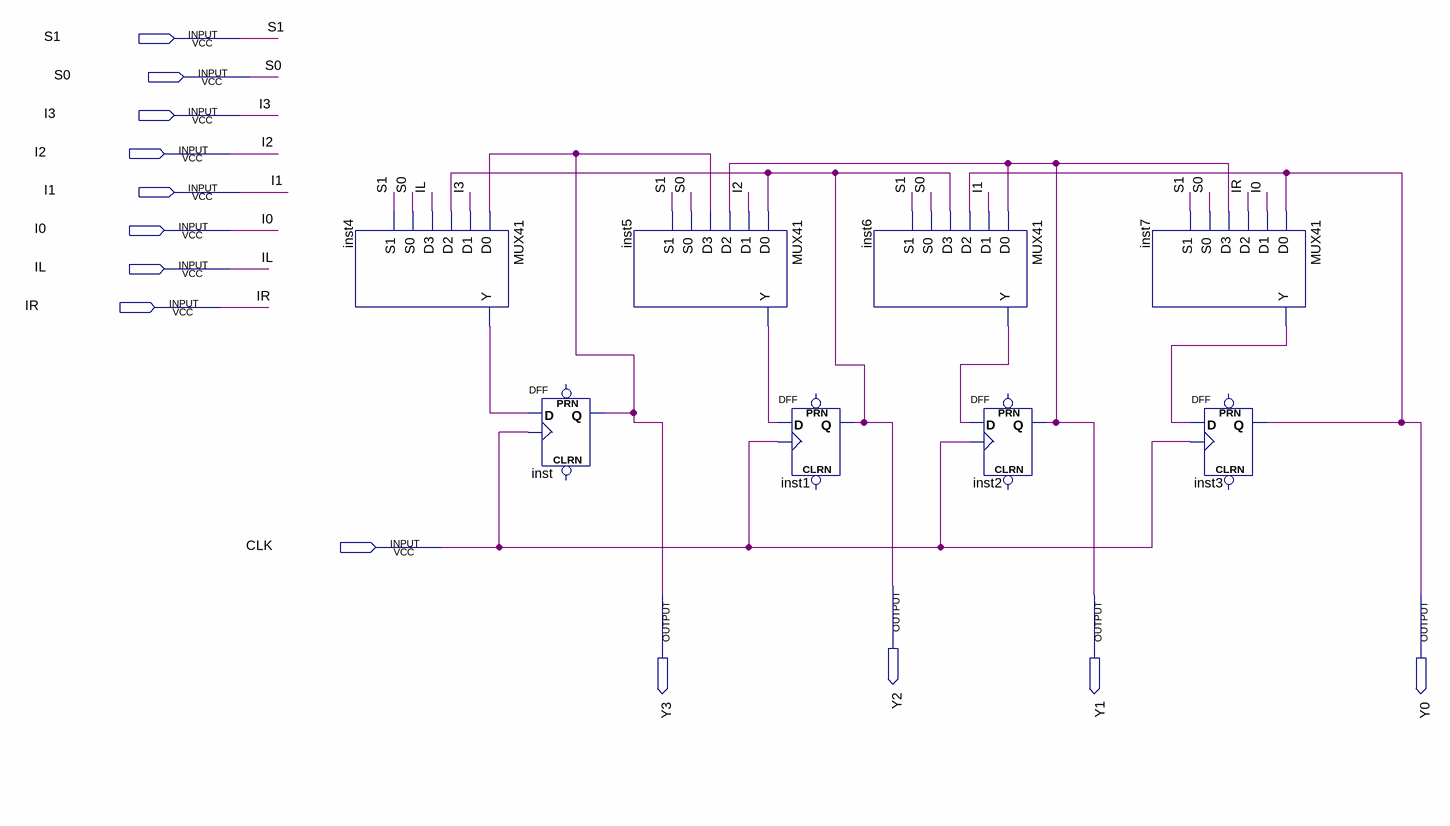
[diagram p0: schematic sheet]
// Quartus schematic Res_4choice.bdf as structural Verilog: 8 symbols, 13 pins
module Res_4choice (
  input  S1,
  input  S0,
  input  I3,
  input  I2,
  input  I1,
  input  I0,
  input  IL,
  input  IR,
  input  CLK,
  output Y2,
  output Y3,
  output Y1,
  output Y0
);

  wire inst4_y, inst5_y, inst6_y, inst7_y;

  MUX41 inst4 (.D0(Y3), .D1(I3), .D2(Y2), .D3(IL), .S0(S0), .S1(S1), .Y(inst4_y));
  DFF inst (.CLK(CLK), .D(inst4_y), .Q(Y3));  // open: CLRN, PRN
  MUX41 inst5 (.D0(Y2), .D1(I2), .D2(Y1), .D3(Y3), .S0(S0), .S1(S1), .Y(inst5_y));
  DFF inst1 (.CLK(CLK), .D(inst5_y), .Q(Y2));  // open: CLRN, PRN
  MUX41 inst6 (.D0(Y1), .D1(I1), .D2(Y0), .D3(Y2), .S0(S0), .S1(S1), .Y(inst6_y));
  DFF inst2 (.CLK(CLK), .D(inst6_y), .Q(Y1));  // open: CLRN, PRN
  MUX41 inst7 (.D0(Y0), .D1(I0), .D2(IR), .D3(Y1), .S0(S0), .S1(S1), .Y(inst7_y));
  DFF inst3 (.CLK(CLK), .D(inst7_y), .Q(Y0));  // open: CLRN, PRN
endmodule
